# EAGLE design Test_Node (EAGLE 7.2.0)
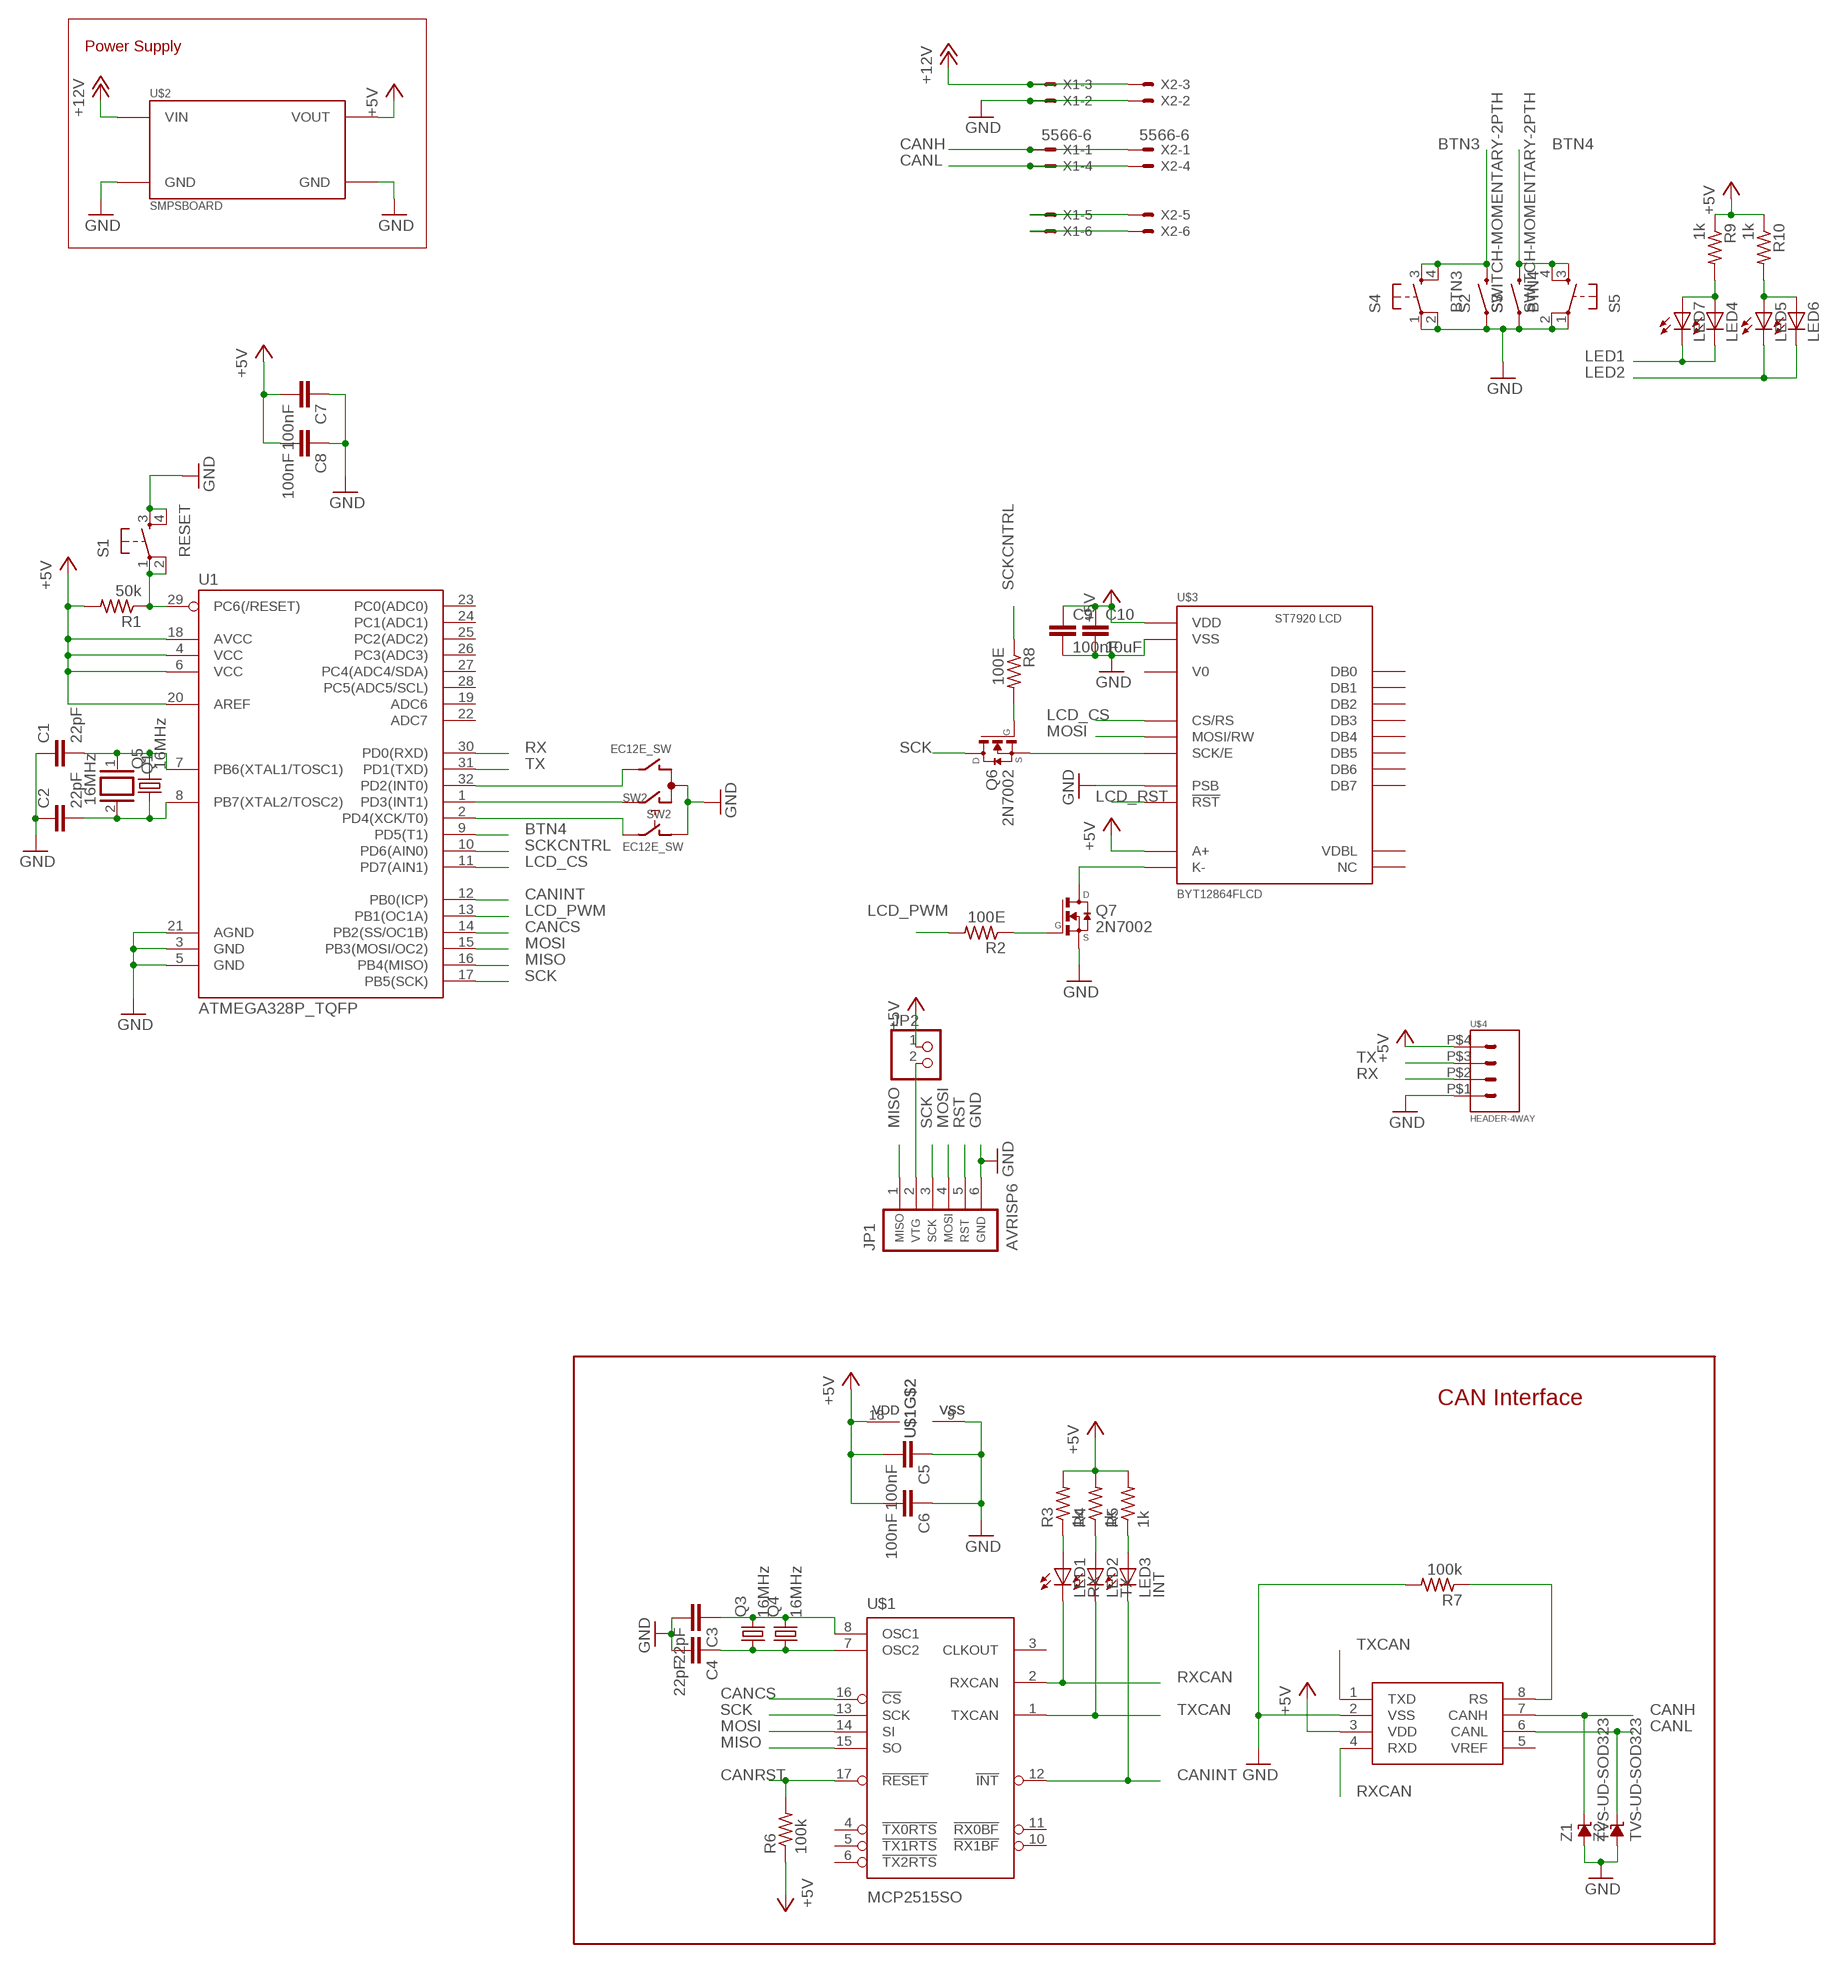
[diagram p0: schematic, sheet 1]

## Parts
C1  22pF  C-EUC0805  [C0805]
C2  22pF  C-EUC0805  [C0805]
C3  22pF  C-EUC0805K  [C0805K]
C4  22pF  C-EUC0805K  [C0805K]
C5  100nF  C-EUC0805K  [C0805K]
C6  100nF  C-EUC0805K  [C0805K]
C7  100nF  C-EUC0805  [C0805]
C8  100nF  C-EUC0805  [C0805]
C9  100nF  C-EUC0805  [C0805]
C10  10uF  C-EUC0805  [C0805]
JP1  AVRISP6  AVR-ISP6-75869-131  [HDR-75869-131]
JP2  PINHD-1X2  [1X02]
LED1  RX  LEDCHIP-LED0805  [CHIP-LED0805]
LED2  TX  LEDCHIP-LED0805  [CHIP-LED0805]
LED3  INT  LEDCHIP-LED0805  [CHIP-LED0805]
LED4  LEDCHIP-LED0805  [CHIP-LED0805]
LED5  LEDCHIP-LED0805  [CHIP-LED0805]
LED6  LED5MM  [LED5MM]
LED7  LED5MM  [LED5MM]
Q1  16MHz  XTAL/S  [QS]
Q3  16MHz  CRYSTALHC49S  [HC49/S]
Q4  16MHz  CRYSTALHC49UP  [HC49UP]
Q5  16MHz  CRYSTALHC49UP  [HC49UP]
Q6  2N7002  [SOT23]
Q7  2N7002  [SOT23]
R1  50k  R-US_R0805  [R0805]
R2  100E  R-US_R0805  [R0805]
R3  1k  R-US_R0805  [R0805]
R4  1k  R-US_R0805  [R0805]
R5  1k  R-US_R0805  [R0805]
R6  100k  R-US_R0805  [R0805]
R7  100k  R-US_R0805  [R0805]
R8  100E  R-US_R0805  [R0805]
R9  1k  R-US_R0805  [R0805]
R10  1k  R-US_R0805  [R0805]
S1  RESET  TAC_SWITCHSMD  [TACTILE_SWITCH_SMD]
S2  SWITCH-MOMENTARY-2PTH  [TACTILE-PTH]
S3  SWITCH-MOMENTARY-2PTH  [TACTILE-PTH]
S4  BTN3  TAC_SWITCHSMD  [TACTILE_SWITCH_SMD]
S5  BTN4  TAC_SWITCHSMD  [TACTILE_SWITCH_SMD]
SW2  EC12E_SW  [ALPS_EC12E_SW]
U1  ATMEGA328P_TQFP  [TQFP32-08]
U2  MCP2551  [SO08]
U$1  MCP2515SO  [SO-18W]
U$2  SMPSBOARD  [SMPSBOARD]
U$3  BYT12864FLCD  [BYT12864F]
U$4  HEADER-4WAY  [1744426-4]
X1  5566-6  [5566-6]
X2  5566-6  [5566-6]
Z1  TVS-UD-SOD323  [SOD323]
Z2  TVS-UD-SOD323  [SOD323]

## Nets
+5V: C5.2 C6.2 C7.2 C8.2 C9.1 C10.1 JP2.1 R1.2 R3.2 R4.2 R5.2 R6.1 R9.1 R10.1 U1.4(VCC) U1.6(VCC) U1.18(AVCC) U1.20(AREF) U2.3(VDD) U$1.18(VDD) U$2.VOUT U$3.P$2(A+) U$3.P$19(VDD) U$4.P$4
+12V: U$2.VIN X1.3 X2.3
BTN3: S2.3 S4.3 S4.4
BTN4: S3.3 S5.3 S5.4 U1.9(PD5(T1))
CANCS: U1.14(PB2(SS/OC1B)) U$1.16(!CS)
CANH: U2.7(CANH) X1.1 X2.1 Z1.C
CANINT: LED3.C U1.12(PB0(ICP)) U$1.12(!INT)
CANL: U2.6(CANL) X1.4 X2.4 Z2.C
CANRST: R6.2 U$1.17(!RESET)
CANSTBY: R7.1 U2.8(RS)
GND: C1.1 C2.1 C3.2 C4.2 C5.1 C6.1 C7.1 C8.1 C9.2 C10.2 JP1.6 Q7.2(S) R7.2 S1.3 S1.4 S2.1 S3.1 S4.1 S4.2 S5.1 S5.2 SW2.C SW2.D U1.3(GND) U1.5(GND) U1.21(AGND) U2.2(VSS) U$1.9(VSS) U$2.GND U$2.GND@(GND) U$3.P$6(PSB) U$3.P$20(VSS) U$4.P$1 X1.2 X2.2 Z1.A Z2.A
LCD_CS: U1.11(PD7(AIN1)) U$3.P$17(CS/RS)
LCD_PWM: R2.2 U1.13(PB1(OC1A))
LCD_RST: U$3.P$4(!RST)
LED1: LED4.C LED7.K(C)
LED2: LED5.C LED6.K(C)
MISO: JP1.1 U1.16(PB4(MISO)) U$1.15(SO)
MOSI: JP1.4 U1.15(PB3(MOSI/OC2)) U$1.14(SI) U$3.P$16(MOSI/RW)
N$1: C1.2 Q1.1 Q5.2 U1.7(PB6(XTAL1/TOSC1))
N$2: C2.2 Q1.2 Q5.1 U1.8(PB7(XTAL2/TOSC2))
N$3: C3.1 Q3.2 Q4.2 U$1.8(OSC1)
N$4: Q7.3(D) U$3.P$1(K-)
N$5: Q7.1(G) R2.1
N$6: C4.1 Q3.1 Q4.1 U$1.7(OSC2)
N$7: LED1.A R3.1
N$8: LED2.A R4.1
N$9: LED3.A R5.1
N$10: JP1.2 JP2.2
N$11: Q6.2(S) U$3.P$15(SCK/E)
N$12: Q6.1(G) R8.2
N$13: LED4.A LED7.A R9.2
N$14: X1.5 X2.5
N$15: X1.6 X2.6
N$16: LED5.A LED6.A R10.2
N$17: SW2.A U1.1(PD3(INT1))
N$18: SW2.B U1.32(PD2(INT0))
N$19: SW2.E U1.2(PD4(XCK/T0))
RST: JP1.5 R1.1 S1.1 S1.2 U1.29(PC6(/RESET))
RX: U1.30(PD0(RXD)) U$4.P$2
RXCAN: LED1.C U2.4(RXD) U$1.2(RXCAN)
SCK: JP1.3 Q6.3(D) U1.17(PB5(SCK)) U$1.13(SCK)
SCKCNTRL: R8.1 U1.10(PD6(AIN0))
TX: U1.31(PD1(TXD)) U$4.P$3
TXCAN: LED2.C U2.1(TXD) U$1.1(TXCAN)
Unconnected: SW2.GND1(G) SW2.GND2(G) U1.19(ADC6) U1.22(ADC7) U1.23(PC0(ADC0)) U1.24(PC1(ADC1)) U1.25(PC2(ADC2)) U1.26(PC3(ADC3)) U1.27(PC4(ADC4/SDA)) U1.28(PC5(ADC5/SCL)) U2.5(VREF) U$1.3(CLKOUT) U$1.4(!TX0RTS) U$1.5(!TX1RTS) U$1.6(!TX2RTS) U$1.10(!RX1BF) U$1.11(!RX0BF) U$3.P$3(VDBL) U$3.P$5(NC) U$3.P$7(DB7) U$3.P$8(DB6) U$3.P$9(DB5) U$3.P$10(DB4) U$3.P$11(DB3) U$3.P$12(DB2) U$3.P$13(DB1) U$3.P$14(DB0) U$3.P$18(V0)

## Notes on the sheet
- Power Supply
- CAN Interface

## Library data of the parts
C1-C10 = resistor:C-EU: CAPACITOR, European symbol
JP1 = atmel-avr:AVR-ISP6-: AVR ISP-6 Serial Programming Header
JP2 = pinhead:PINHD-1X2: PIN HEADER
LED1-LED7 = led:LED: LED OSRAM: - CHIPLED LG R971, LG N971, LY N971, LG Q971, LY Q971, LO R971, LY R971 LH N974, LH R974 LS Q976, LO Q976, LY Q976 LO Q996 - Hyper CHIPLED LW Q18S LB Q993, LB Q99A, LB R99A - SideLED LS A670, LO A670, LY A670, LG A670, LP A670 LB A673, LV A673, LT A673, LW A673 LH A674 LY A675 LS A676, LA A676, LO A676, LY A676, LW A676 LS A679, LY A679, LG A679 - Hyper Micro SIDELED® LS Y876, LA Y876, LO Y876, LY Y876 LT Y87S - SmartLED LW L88C, LW L88S LB L89C, LB L89S, LG L890 LS L89K, LO L89K, LY L89K LS L896, LA L896, LO L896, LY L896 - TOPLED LS T670, LO T670, LY T670, LG T670, LP T670 LSG T670, LSP T670, LSY T670, LOP T670, LYG T670 LG T671, LOG T671, LSG T671 LB T673, LV T673, LT T673, LW T673 LH T674 LS T676, LA T676, LO T676, LY T676, LB T676, LH T676, LSB T676, LW T676 LB T67C, LV T67C, LT T67C, LS T67K, LO T67K, LY T67K, LW E67C LS E67B, LA E67B, LO E67B, LY E67B, LB E67C, LV E67C, LT E67C LW T67C LS T679, LY T679, LG T679 LS T770, LO T770, LY T770, LG T770, LP T770 LB T773, LV T773, LT T773, LW T773 LH T774 LS E675, LA E675, LY E675, LS T675 LS T776, LA T776, LO T776, LY T776, LB T776 LHGB T686 LT T68C, LB T68C - Hyper Mini TOPLED® LB M676 - Mini TOPLED Santana® LG M470 LS M47K, LO M47K, LY M47K Source: http://www.osram.convergy.de LUXEON: - LUMILED® LXK2-PW12-R00, LXK2-PW12-S00, LXK2-PW14-U00, LXK2-PW14-V00 LXK2-PM12-R00, LXK2-PM12-S00, LXK2-PM14-U00 LXK2-PE12-Q00, LXK2-PE12-R00, LXK2-PE12-S00, LXK2-PE14-T00, LXK2-PE14-U00 LXK2-PB12-K00, LXK2-PB12-L00, LXK2-PB12-M00, LXK2-PB14-N00, LXK2-PB14-P00, LXK2-PB14-Q00 LXK2-PR12-L00, LXK2-PR12-M00, LXK2-PR14-Q00, LXK2-PR14-R00 LXK2-PD12-Q00, LXK2-PD12-R00, LXK2-PD12-S00 LXK2-PH12-R00, LXK2-PH12-S00 LXK2-PL12-P00, LXK2-PL12-Q00, LXK2-PL12-R00 Source: www.luxeon.com KINGBRIGHT: KA-3528ASYC Source: www.kingbright.com
Q1 = special:XTAL/S: CRYSTAL
Q3 = crystal:CRYSTAL: CRYSTAL; OC_FARNELL: 1667008; OC_NEWARK: unknown
Q4 Q5 = crystal:CRYSTAL: CRYSTAL; OC_FARNELL: unknown; OC_NEWARK: unknown
Q6 Q7 = transistor-fet:2N7002*: N-Channel MOSFET
R1-R10 = resistor:R-US_: RESISTOR, American symbol
S1 S4 S5 = SparkFun:TAC_SWITCH: Momentary Switch Button commonly used for reset or general input. Spark Fun Electronics SKU : COM-00097
S2 S3 = SparkFun:SWITCH-MOMENTARY-2
SW2 = switch-alps:EC12E_SW: ALPS rotary Encoder EC12E series with switch; MPN: EC12E2424407; OC_FARNELL: 1520813; OC_NEWARK: 74M1068
U1 = SparkFun-DigitalIC:ATMEGA328P_TQFP; PROD_ID: IC-09069
U2 = SparkFun:MCP2551
U$1 = RobThePyro:MCP2515: MCP2515 CAN Controller by Microchip
U$2 = RobThePyro:SMPSBOARD
U$3 = RobThePyro:BYT12864FLCD: ST7920 / BYT12864F Based GFX LCD
U$4 = con-TE-EP:HEADER-4WAY
X1 X2 = con-molex:5566-6: Mini FIT connector 6 pol Source: http://www.molex.com; MPN: 95566-61002; OC_FARNELL: unknown; OC_NEWARK: 22K8620
Z1 Z2 = supressor:TVS-UD-: TVS UNI-DIRECTIONAL

## Board
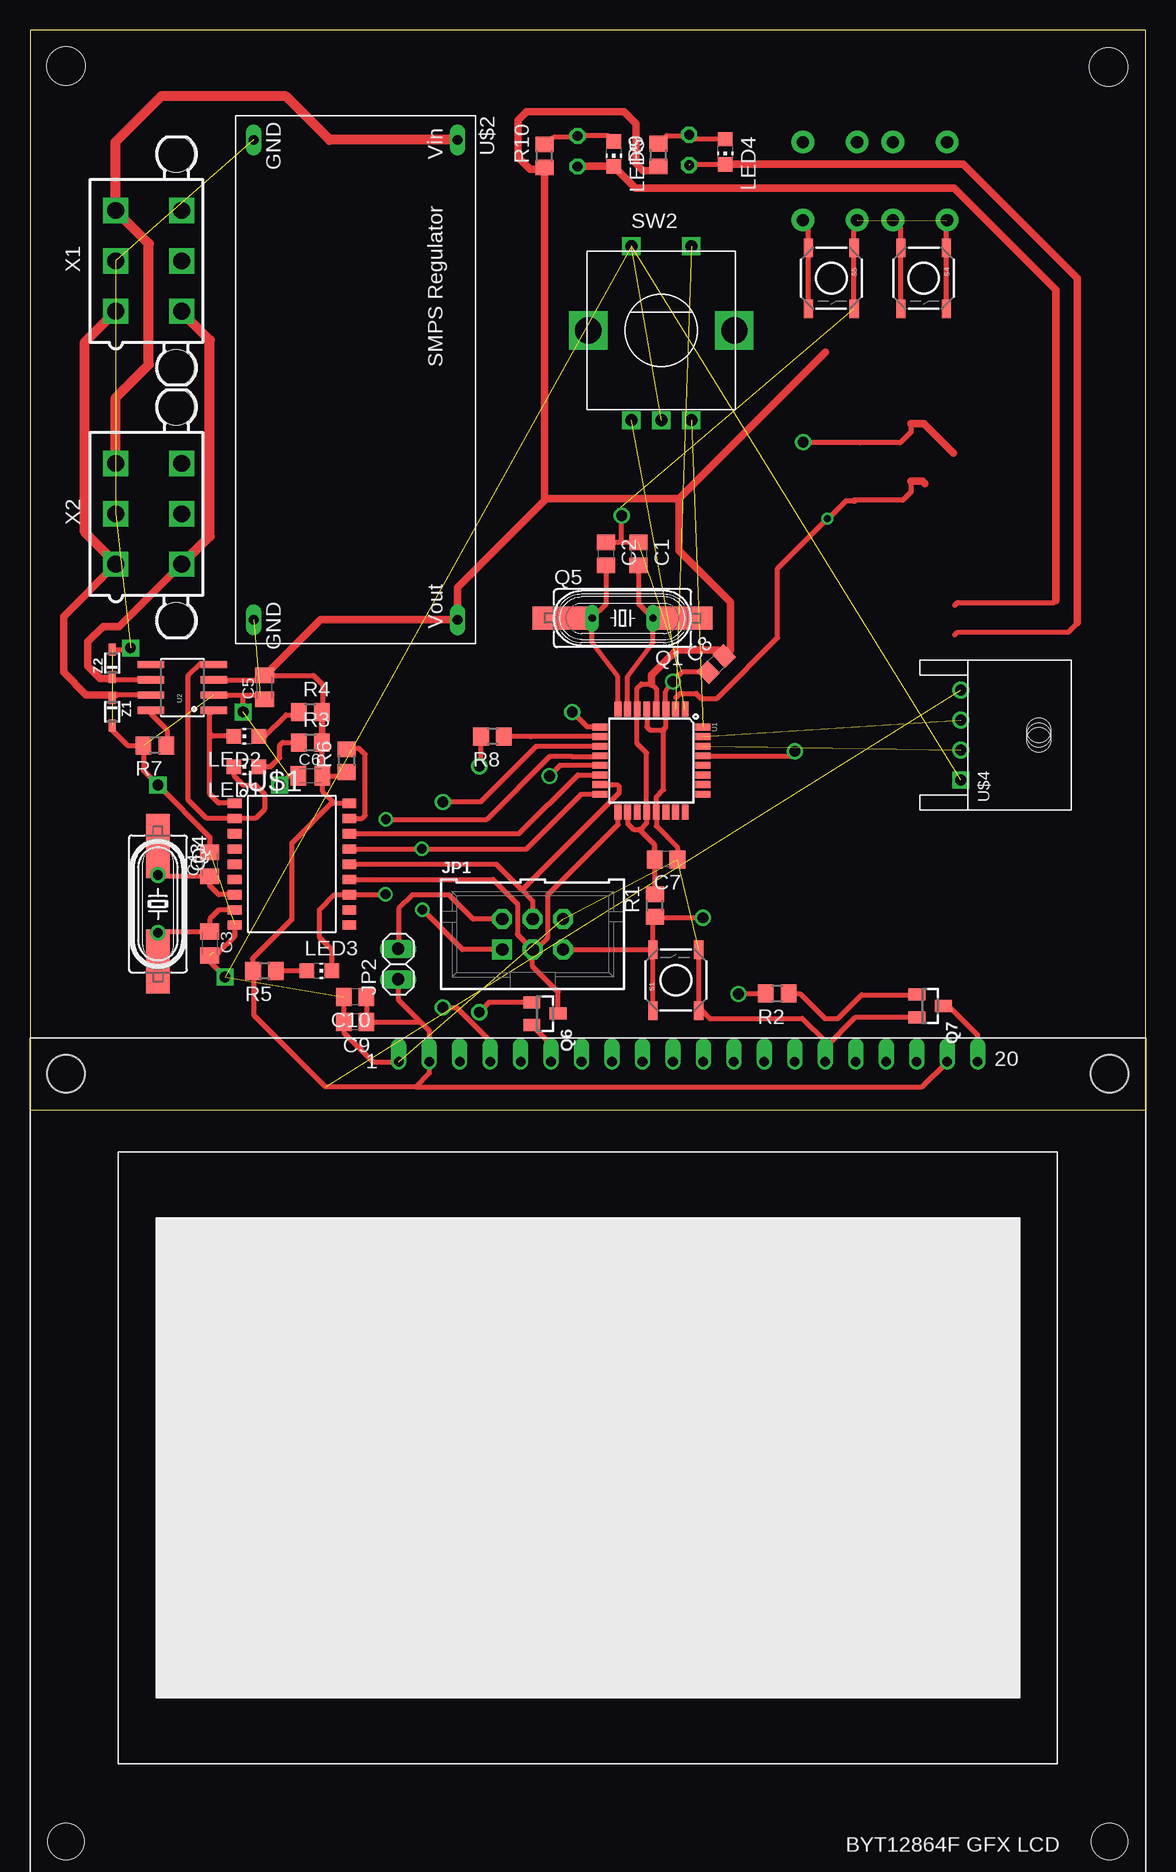
[diagram p1: board, top side]
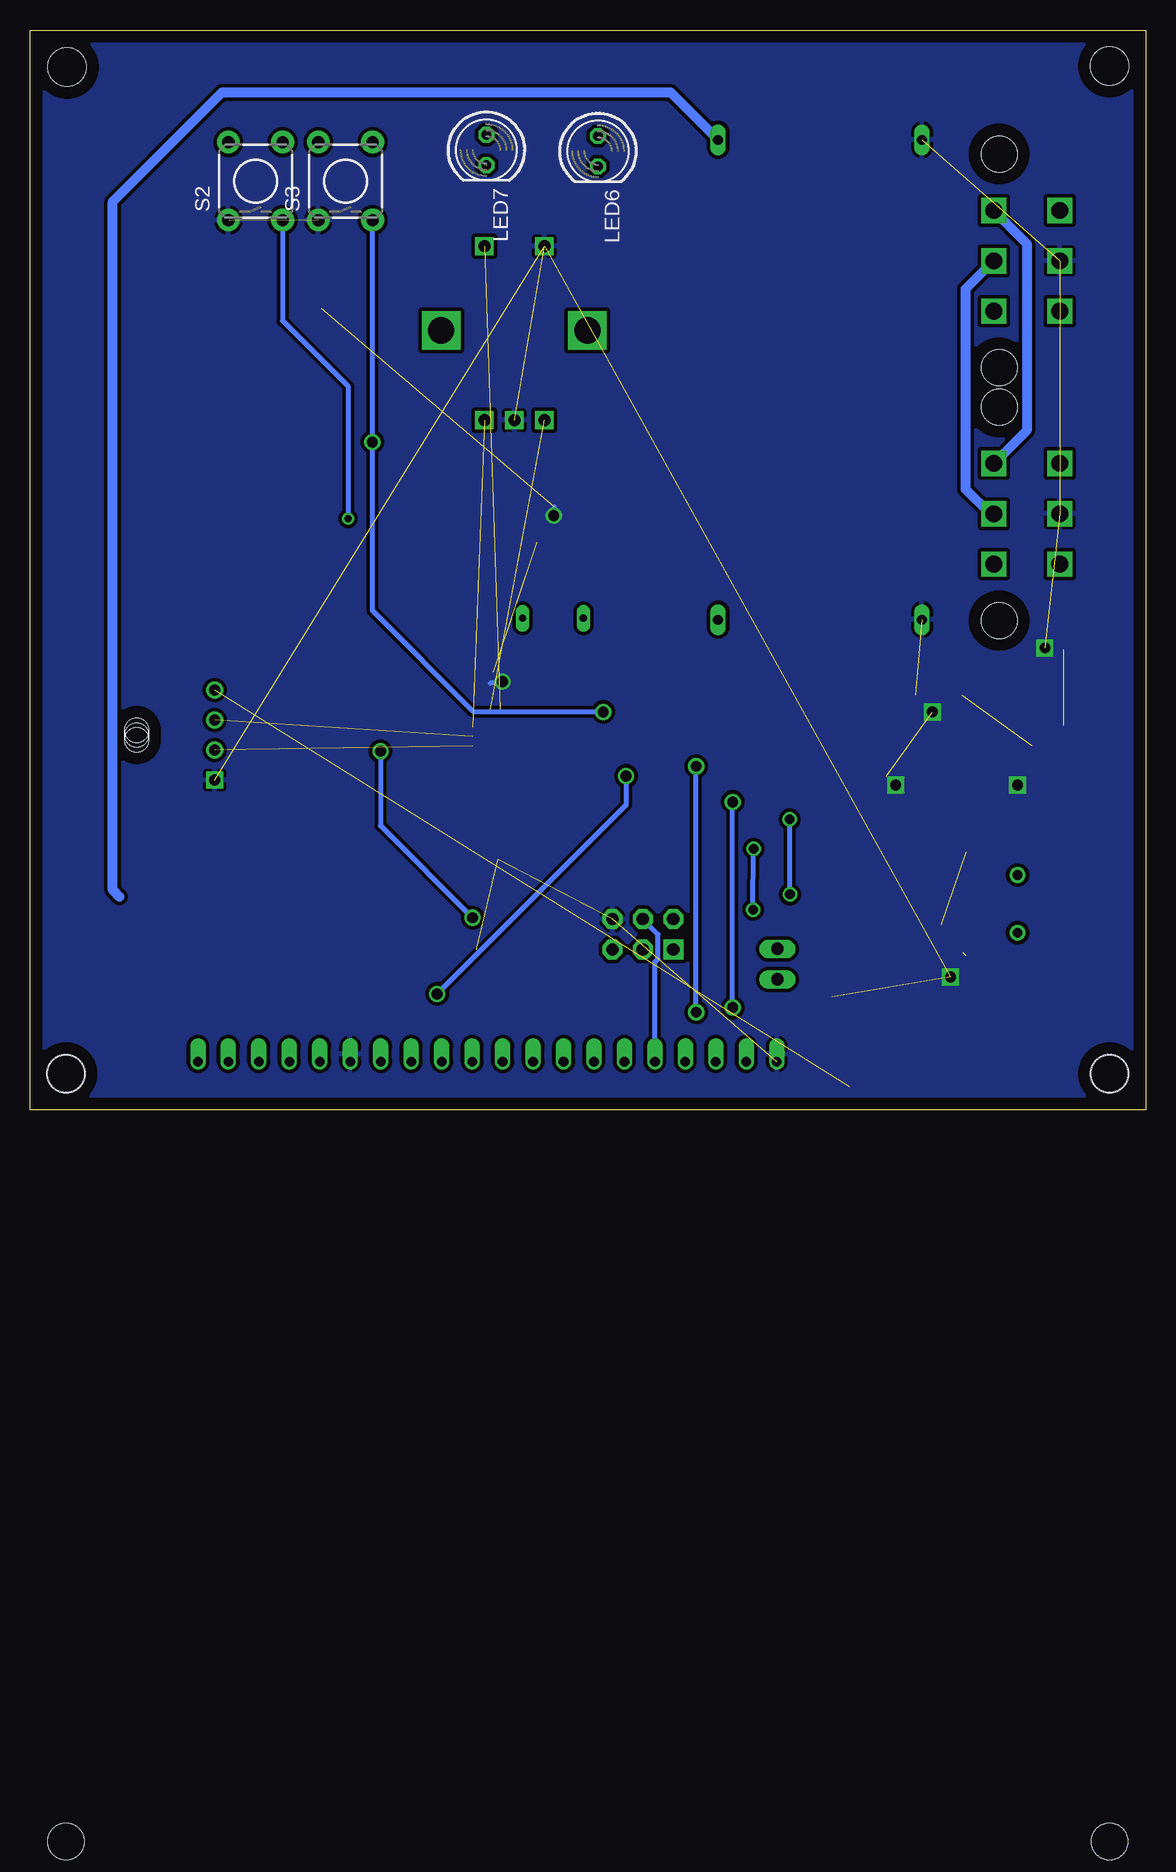
[diagram p2: board, bottom side, seen from below]

Size 93 x 90 mm. Coordinates in mm from the lower left corner, seen from the top.
Outline: 0,0 93,0 93,90 0,90 0,0
Copper layers (1*16): Top 0.035mm / dielectric 1.5mm / Bottom 0.035mm
Design rules "default": minimum track width 10mil, minimum drill 24mil, track to track 8mil, track to pad 8mil, pad to pad 8mil, via to via 8mil, smd to smd 8mil, copper to edge 40mil, drill to drill 8mil, minimum pad ring 10mil, minimum via ring 8mil, stop-mask expansion 4mil, vias tented up to drill 0mil, thermal gap 10mil
Holes 3.2 mm at 3,3 3,87 89.9,86.9 90,3

### Footprints (pad centres in the part's own frame; a part is rotated, then mirrored left to right if it is on the bottom)
C0805 = smd 1.3 x 1.5: 1 -0.95,0; 2 0.95,0
C0805K = smd 1.3 x 1.6: 1 -1,0; 2 1,0
HDR-75869-131 = drill 1.016 pad 1.676 square: 1 -2.54,-1.27 | drill 1.016 pad 1.676 octagon: 2 -2.54,1.27; 3 0,-1.27; 4 0,1.27; 5 2.54,-1.27; 6 2.54,1.27
1X02 = drill 1.016 long: 1 -1.27,0; 2 1.27,0
CHIP-LED0805 = smd 1.2 x 1.2: A 0,-1.05; C 0,1.05
LED5MM = drill 0.813 octagon: A -1.27,0; K 1.27,0
QS = drill 0.61 long: 1 -2.54,0; 2 2.54,0
HC49/S = drill 0.813: 1 -2.413,0; 2 2.413,0
HC49UP = smd 5.334 x 1.93: 1 -4.826,0; 2 4.826,0
SOT23 = smd 1 x 1.4: 1 -0.95,-1.1; 2 0.95,-1.1; 3 0,1.1
R0805 = smd 1.3 x 1.5: 1 -0.95,0; 2 0.95,0
TACTILE_SWITCH_SMD = smd 1.524 x 0.762: 1 -2.54,1.905; 2 2.54,1.905; 3 -2.54,-1.905; 4 2.54,-1.905
TACTILE-PTH = drill 1.016 pad 1.88: 1 -3.251,2.261; 2 3.251,2.261; 3 -3.251,-2.261; 4 3.251,-2.261
ALPS_EC12E_SW = drill 1 square: A -2.5,-7.5; B 2.5,-7.5; C 0,-7.5; D -2.5,7; E 2.5,7 | drill 2.2 square: GND1 -6.1,0; GND2 6.1,0
TQFP32-08 = smd 1.27 x 0.559: 1 -4.293,2.8; 2 -4.293,2; 3 -4.293,1.2; 4 -4.293,0.4; 5 -4.293,-0.4; 6 -4.293,-1.2; 7 -4.293,-2; 8 -4.293,-2.8; 17 4.293,-2.8; 18 4.293,-2; 19 4.293,-1.2; 20 4.293,-0.4; 21 4.293,0.4; 22 4.293,1.2; 23 4.293,2; 24 4.293,2.8 | smd 0.559 x 1.27: 9 -2.8,-4.293; 10 -2,-4.293; 11 -1.2,-4.293; 12 -0.4,-4.293; 13 0.4,-4.293; 14 1.2,-4.293; 15 2,-4.293; 16 2.8,-4.293; 25 2.8,4.293; 26 2,4.293; 27 1.2,4.293; 28 0.4,4.293; 29 -0.4,4.293; 30 -1.2,4.293; 31 -2,4.293; 32 -2.8,4.293
SO08 = smd 0.61 x 2.21: 1 -1.905,-2.616; 2 -0.635,-2.616; 3 0.635,-2.616; 4 1.905,-2.616; 5 1.905,2.616; 6 0.635,2.616; 7 -0.635,2.616; 8 -1.905,2.616
SO-18W = smd 0.762 x 1.143: 1 -5.08,-4.788; 2 -3.81,-4.788; 3 -2.54,-4.788; 4 -1.27,-4.788; 5 0,-4.788; 6 1.27,-4.788; 7 2.54,-4.788; 8 3.81,-4.788; 9 5.08,-4.788; 10 5.08,4.788; 11 3.81,4.788; 12 2.54,4.788; 13 1.27,4.788; 14 0,4.788; 15 -1.27,4.788; 16 -2.54,4.788; 17 -3.81,4.788; 18 -5.08,4.788
SMPSBOARD = drill 0.8 long: GND 2,1.5; GND@ 42,1.5; VIN 2,18.5; VOUT 42,18.5
BYT12864F = drill 0.8 offset: P$1 14,2; P$2 16.54,2; P$3 19.08,2; P$4 21.62,2; P$5 24.16,2; P$6 26.7,2; P$7 29.24,2; P$8 31.78,2; P$9 34.32,2; P$10 36.86,2; P$11 39.4,2; P$12 41.94,2; P$13 44.48,2; P$14 47.02,2; P$15 49.56,2; P$16 52.1,2; P$17 54.64,2; P$18 57.18,2; P$19 59.72,2; P$20 62.26,2 | hole 3: 3,3; 90,3; 90,67; 3,67
1744426-4 = drill 0.9 square: P$1 -3.75,6.5 | drill 0.9: P$2 -1.25,6.5; P$3 1.25,6.5; P$4 3.75,6.5 | hole 2: 0,0; -0.4,0; 0.4,0
5566-6 = drill 1.4 square: 1 4.2,-2.75; 2 0,-2.75; 3 -4.2,-2.75; 4 4.2,2.75; 5 0,2.75; 6 -4.2,2.75 | hole 3: 8.9,2.29; -8.9,2.29
SOD323 = smd 1 x 0.6: A 1.143,0; C -1.143,0

### Placement (x,y rotation side)
C1  50.75,46.33 270 top
C2  48.01,46.33 270 top
C3  14.99,13.86 270 top
C4  14.99,20.46 90 top
C5  19.56,35.19 90 top
C6  23.37,27.83 0 top
C7  53.02,20.88 180 top
C8  57.21,37.14 45 top
C9  27.1,7.3 180 top
C10  27.1,9.4 180 top
JP1  41.91,14.62 0 top
JP2  30.69,12.14 90 top
LED1  18.03,28.59 90 top
LED2  18.03,31.13 90 top
LED3  24.13,11.57 270 top
LED4  57.97,79.84 180 top
LED5  48.68,79.67 180 top
LED6  45.65,79.9 270 bottom
LED7  54.95,80 270 bottom
Q1  49.4,40.97 180 top
Q3  10.67,17.16 270 top
Q4  10.67,17.16 270 top
Q5  49.4,40.97 0 top
Q6  42.93,8 270 top
Q7  75.05,8.64 270 top
R1  52.09,17.02 90 top
R2  62.3,9.67 180 top
R3  23.37,30.62 0 top
R4  23.37,33.16 0 top
R5  19.56,11.57 180 top
R6  26.42,29.1 90 top
R7  10.41,30.37 180 top
R8  38.56,31.11 180 top
R9  52.39,79.58 90 top
R10  42.88,79.49 90 top
S1  53.85,10.79 90 top
S2  74.2,77.4 90 bottom
S3  66.7,77.4 90 bottom
S4  74.5,69.3 270 top
S5  66.8,69.3 270 top
SW2  52.62,64.97 0 top
U1  51.82,29.1 270 top
U2  12.7,35.19 90 top
U$1  21.84,20.46 270 top
U$2  17.14,82.84 270 top
U$3  93,6 180 top
U$4  84.1,31.23 90 top
X1  9.91,70.75 270 top
X2  9.91,49.67 270 top
Z1  6.86,33.16 270 top
Z2  6.86,37.23 90 top

### Tracks (layer width: path | path; a pad name or v marks a point on that pad's centre or on a via)
+5V  (1 unrouted)
  Top 0.406: U2.3 19.19,35.83 C5.2 23.64,36.19 24.38,35.45 24.38,31.2 R4.2 R3.2 24.32,27.88 C6.2 | 25.4,25.54 25.15,25.54 21.84,22.24 21.84,15.89 18.54,12.59 18.54,12.06 | 25.4,25.54 U$1.18 | C6.2 24.37,26.57 25.4,25.54 | C6.2 26.1,27.83 R6.1 | 18.54,12.06 18.54,11.64 R5.2 | 32.13,1.91 33.28,3.05 U$3.P$19 33.27,6.6 32.54,7.34 | 32.13,1.91 24.64,1.91 18.67,7.87 18.67,11.94 18.54,12.06 | 32.13,1.91 74.36,1.91 U$3.P$2 | JP2.1 30.69,9.18 32.54,7.34 | U1.4 52.22,35.08 51.82,35.48 50.98,35.48 50.62,35.13 U1.6 50.62,30.53 51.42,29.74 U1.20 51.44,24.79 51.44,23.88 50.93,23.37 50.8,23.37 | U1.18 49.82,23.84 50.29,23.37 50.8,23.37 | R1.2 52.09,21.85 | 52.09,21.85 52.09,22.08 50.8,23.37 | C10.1 C9.1 32.5,7.3 32.54,7.34 | C7.2 52.08,21.84 52.09,21.85
  Top 0.61: C5.2 24.21,40.84 U$2.VOUT 35.65,43.52 42.88,50.76 | 42.88,50.76 43.05,50.93 54.1,50.93 | 66.32,63.15 54.1,50.93 | R9.1 52.74,78.28 51.12,78.28 50.5,78.9 50.5,82.2 49.5,83.2 41.4,83.2 40.7,82.5 40.7,79.4 41.7,78.4 42.74,78.4 R10.1 42.88,50.76 | 54.1,50.93 54.1,46.6 58.4,42.3 58.4,38.32 C8.2 57.39,38.3 53.9,38.3 51.82,36.22 51.82,35.48
+12V
  Top 0.813: X2.3 7.16,59.37 9.91,62.12 9.91,72.2 X1.3 7.11,75 7.11,80.66 10.92,84.47 21.34,84.47 24.96,80.84 U$2.VIN
  Bottom 0.813: 85.55,17.75 86.1,18.3 86.1,75.7 77,84.8 39.6,84.8 U$2.VIN
BTN3  (via drill 0.6)
  Top 0.406: 53.82,34.32 54.2,34.7 55.52,34.7 55.95,34.27 57.25,34.27 62.33,39.35 62.33,45.12 v66.47,49.27 | S4.4 S4.3 72.59,73.49 S2.3 | 73.45,52.4 73.45,51.5 72.75,50.8 68.65,50.8 68.6,50.75 | 68.6,50.75 68.83,50.75 | 68.6,50.75 68.03,50.75 66.53,49.25 66.5,49.27 v66.47,49.27 | 66.53,49.23 v66.47,49.27
  Top 0.61: 74.6,52.2 74.4,52.4 73.45,52.4
  Bottom 0.406: S2.3 71.94,65.76 66.47,60.3 v66.47,49.27 66.51,49.24
BTN4  (via drill 0.9, 0.9 pad 1.27)
  Top 0.406: U1.9 46.46,31.9 v45.21,33.15 | S5.4 S5.3 64.89,73.69 S3.3 | 73.45,57.2 73.45,56.5 72.55,55.6 69.22,55.6 64.5,55.6 v64.45,55.65
  Top 0.61: 76.97,54.73 74.5,57.2 73.45,57.2
  Bottom 0.406: v45.21,33.15 56.01,33.15 56.01,33.16 64.45,41.6 v64.45,55.65 64.45,56.7 64.45,74.14 S3.3
CANCS
  Top 0.406: U1.14 45.67,27.9 40.77,23 U$1.16
CANH
  Top 0.406: U2.7 7.11,34.56 Z1.C
  Top 0.61: 7.11,34.56 4.7,34.56 2.79,36.46 2.79,41.11 X2.1
  Top 0.813: X2.1 7.16,45.56 4.57,48.15 4.57,63.97 X1.1
CANINT  (via drill 0.8)
  Top 0.406: LED3.C 25.18,13.32 24.13,14.37 24.13,16.65 25.4,17.92 U$1.12 28.85,17.92 v29.64,17.95 | U1.12 47.48,29.45 45.16,29.45 45.15,29.44 43.33,29.44 38.09,24.2 v29.67,24.2
  Bottom 0.406: v29.64,17.95 29.64,24.17 v29.67,24.2
CANL
  Top 0.406: U2.6 7.11,35.83 Z2.C
  Top 0.61: X2.4 7.46,40.27 6.1,40.27 4.83,39 4.83,36.97 5.84,35.96 6.73,35.96 Z2.C
  Top 0.813: X2.4 14.99,47.8 14.99,64.15 12.66,66.48 X1.4
CANRST
  Top 0.406: U$1.17 27.69,24.27 27.94,24.53 27.94,29.61 27.43,30.11 26.48,30.11 R6.2
CANSTBY
  Top 0.406: U2.8 10.08,32.98 11.43,31.64 11.43,30.43 R7.1
GND  (via drill 0.9 pad 1.27, 0.9 pad 1.42)  (19 unrouted)
  Top 0.406: U2.2 17.78,34.56 | 17.78,34.56 19.19,34.56 C5.1 | U$1.9 17.06,14.4 15.75,13.1 15.22,13.1 | Z1.A 6.86,31.64 8.13,30.37 R7.2 9.46,28.27 v10.67,27.07 14.99,22.75 C4.2 | C6.1 21.59,27.83 v20.83,27.07 | v17.78,33.16 17.78,34.56 | Z2.A 8.26,38.37 v8.38,38.5 | C3.2 14.99,12.33 v16.26,11.06 | C1.1 49.33,47.28 | 49.33,47.28 C2.1 | 66.29,5.21 66.29,5.71 64.39,7.62 56.64,7.62 56.01,8.26 S1.3 S1.4 | 66.29,5.21 U$3.P$6 | Q7.2 68.77,7.69 66.29,5.21 | U1.5 51.44,33.37 51.44,31.9 51.69,31.65 52.78,31.65 | 52.78,31.65 53.02,31.88 U1.3 52.96,33.45 52.96,34.8 53.47,35.69 v53.59,35.69 54.37,36.47 C8.1 | 49.33,47.28 v49.33,49.52 | 52.78,31.65 52.83,31.6 52.83,26.67 52.22,26.05 U1.21 52.22,23.63 53.98,21.88 C7.1 | S5.2 S5.1 68.7,73.89 S3.1 | S4.2 S4.1 76.41,74.09 S2.1 | C10.2 C9.2 26.15,6.45 28.6,4 U$3.P$20
  Bottom 0.406: v53.59,35.69 54.1,35.56 54.61,35.56 | v49.33,49.52 49.28,49.52 49.28,50.23
  pour Bottom (isolate 0.305): 0,0 93,0 93,90 0,90
LCD_CS  (via drill 0.9 pad 1.27)
  Top 0.406: U1.11 42.22,30.3 37.57,25.65 v34.42,25.65 | v34.42,8.51 35.56,8.51 38.35,5.71 U$3.P$17
  Bottom 0.406: v34.42,8.51 v34.42,25.65
LCD_PWM  (via drill 0.9 pad 1.27)
  Top 0.406: U1.13 44.19,28.7 v43.31,27.81 | v59.05,9.65 59.04,9.67 R2.2
  Bottom 0.406: v43.31,27.81 43.31,25.4 v59.05,9.65
LED1  (1 unrouted)
  Top 0.406: 55.01,78.79 LED4.C | 87.3,40.6 87.3,40.58 86.5,39.77 86.47,39.8 77.33,39.8 77.1,39.58
  Top 0.61: LED4.C 77.81,78.79 87.3,69.3 87.3,40.6
LED2
  Top 0.406: 77.1,42.05 77.33,42.27 85.38,42.27 85.53,42.42
  Top 0.61: LED6.K LED5.C 50.48,76.83 77.08,76.83 85.53,68.38 85.53,42.42
MISO  (via drill 0.8)
  Top 0.406: U1.16 45.97,26.3 41.41,21.74 v32.67,21.74 v32.66,21.73 U$1.15 | JP1.1 36.04,13.35 v32.72,16.68
  Bottom 0.406: v32.72,16.68 32.69,21.73 v32.67,21.74
MOSI
  Top 0.406: U1.15 48.97,27.1 49.12,26.94 49.12,26.41 41.02,18.3 | U$1.14 38.86,20.46 41.02,18.3 | 41.02,18.3 41.91,17.41 JP1.4
  Bottom 0.406: U$3.P$16 40.9,12.31 40.64,12.57 40.64,14.62 JP1.4
N$1
  Top 0.406: U1.7 49.82,36.12 51.94,38.94 Q1.1 | C1.2 50.75,42.17 Q1.1 | Q1.1 51.97,40.97 52,41 51.9,41 | Q5.2 Q1.1
N$2
  Top 0.406: U1.8 49.02,36.09 46.86,38.94 Q1.2 | C2.2 48.01,42.12 Q1.2 | Q5.1 Q1.2
N$3
  Top 0.406: Q4.2 Q3.2 10.67,14.86 C3.1 14.99,15.89 15.75,16.65 U$1.8
N$4
  Top 0.406: U$3.P$1 79,6.19 76.55,8.64 Q7.3
N$5
  Top 0.406: R2.1 64.18,9.67 66.25,7.6 67.35,7.6 69.33,9.57 73.94,9.57 Q7.1
N$6
  Top 0.406: Q4.1 Q3.1 10.67,19.46 C4.1 14.99,18.68 15.75,17.92 U$1.7
N$7
  Top 0.406: LED1.A 20.07,28.59 20.83,29.35 20.83,30.37 21.08,30.62 R3.1
N$8
  Top 0.406: LED2.A 19.56,31.13 21.34,32.91 22.16,32.91 R4.1
N$9
  Top 0.406: LED3.A R5.1
N$10
  Top 0.406: JP1.2 36.94,15.89 34.92,17.91 31.88,17.91 30.73,16.76 30.73,13.45 JP2.2
N$11
  Top 0.406: U$3.P$15 43.44,5.44 Q6.2
N$12  (via drill 0.9 pad 1.27)
  Top 0.406: Q6.1 38.29,8.95 v37.47,8.13 | v37.47,28.63 37.61,28.77 R8.2
  Bottom 0.406: v37.47,8.13 v37.47,28.63
N$13
  Top 0.406: R9.2 52.42,80.53 53.1,81.2 54.88,81.2 LED7.A 55.33,80.89 LED4.A
N$14
  Bottom 0.813: X2.5 12.95,49.67 14.99,51.7 14.99,68.42 X1.5
N$15
  Bottom 0.813: X1.6 9.91,72.2 9.91,56.62 X2.6
N$16
  Top 0.406: R10.2 43.04,80.44 43.7,81.1 45.58,81.1 LED6.A 48.23,81.17 LED5.A
N$17  (1 unrouted)
N$18  (1 unrouted)
N$19  (1 unrouted)
RST  (via drill 0.9)
  Top 0.406: JP1.5 51.93,13.35 S1.2 | S1.1 S1.2 | S1.2 51.94,15.93 R1.1 52.15,16 v56.1,16 | U1.29 63.4,29.5 v63.77,29.88
  Bottom 0.406: v63.77,29.88 63.77,23.68 v56.1,16
RX  (1 unrouted)
RXCAN
  Top 0.406: LED1.C 16.98,27.86 17.78,27.07 18.8,27.07 19.56,26.3 19.56,25.03 18.8,24.27 U$1.2 14.73,24.27 13.21,25.8 13.21,36.21 14.22,37.23 15.19,37.23 U2.4
SCK
  Top 0.406: 49,24.79 U1.17 49.02,24.8 49.02,23.76 43.18,17.92 43.18,14.37 42.16,13.35 JP1.3 | U$1.13 38.61,19.19 40.64,17.16 40.64,14.62 JP1.3 | JP1.3 41.91,11.94 44.03,9.82 Q6.3
SCKCNTRL
  Top 0.406: U1.10 41.73,31.1 R8.1
TX  (1 unrouted)
TXCAN
  Top 0.406: U$1.1 15.75,25.54 14.99,26.3 14.99,31.38 | 14.99,31.38 14.99,32.96 U2.1 | LED2.C 15.24,31.13 14.99,31.38